# Altium schematic sheet DDS.SchDoc
size 594 x 420 mm; Address1: Address1; Address2: Address2; Address3: Address3; Address4: Address4; SheetNumber: 1; Scale: 1:1; Разраб.: Иванов; Обозначение документа: АБВГ.123456.001 Э3; Пров.: Петров; Утв.: Сидоров; Наименование организации: ОАО "Концерн "МПО-Гидроприбор"; Перв. применение: АБВГ.123456.000; Наименование изделия 1: Плата; Наименование изделия 2: Схема электрическая; Наименование изделия 3: принципиальная; Нач. отд.: Нач. отд.; Фамилия нач. отд.: Сидоров
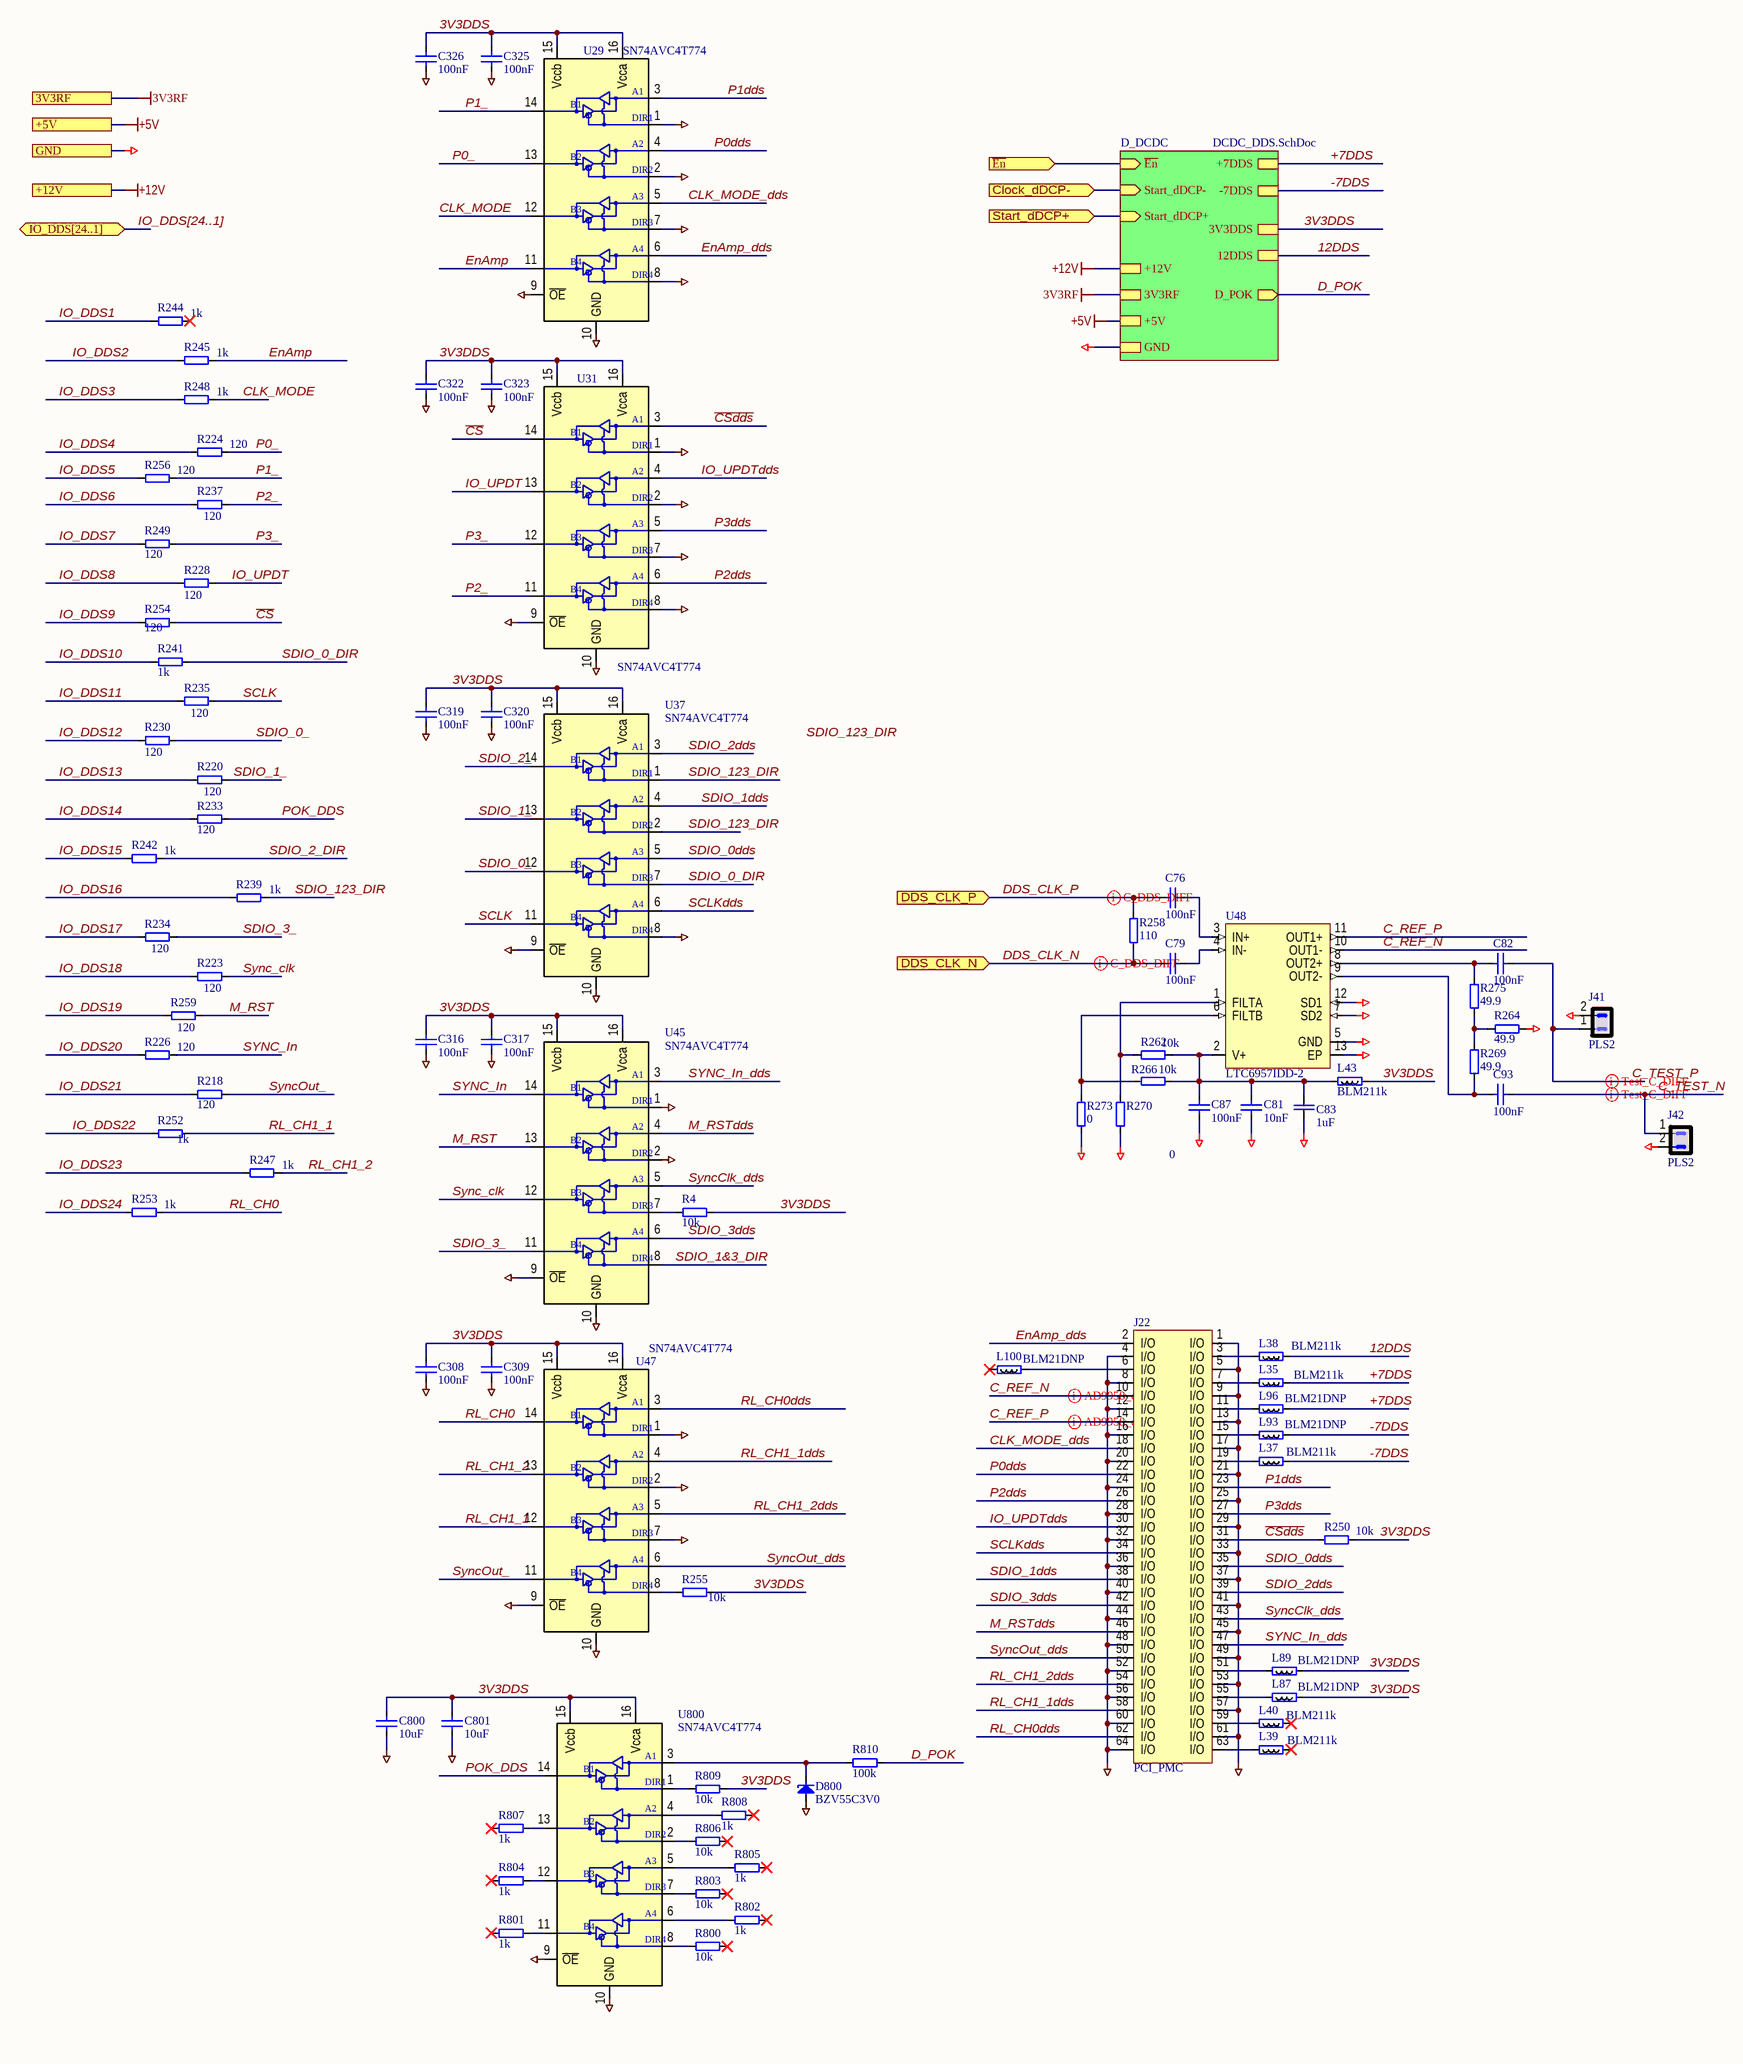
[diagram p0: DDS.SchDoc]

## Parts
C76  100nF  [CAPC1608X87N]
C79  100nF  [CAPC1608X87N]
C81  10nF  [CAPC1608X87N]
C82  100nF  [CAPC1608X87N]
C83  1uF  [0508]
C87  100nF  [CAPC1608X87N]
C93  100nF  [CAPC1608X87N]
C308  100nF  [SMD0805CAP]
C309  100nF  [SMD0805CAP]
C316  100nF  [SMD0805CAP]
C317  100nF  [SMD0805CAP]
C319  100nF  [SMD0805CAP]
C320  100nF  [SMD0805CAP]
C322  100nF  [SMD0805CAP]
C323  100nF  [SMD0805CAP]
C325  100nF  [SMD0805CAP]
C326  100nF  [SMD0805CAP]
C800  10uF  [SMD0805CAP]
C801  10uF  [SMD0805CAP]
D800  BZV55C3V0  [DIOMELF3516N]
J22  PCI_PMC  [TYCO_120521-1]
J41  PLS2  [PLS2]
J42  PLS2  [PLS2]
L35  BLM211k  [RESC2012X50N]
L37  BLM211k  [RESC2012X50N]
L38  BLM211k  [RESC2012X50N]
L39  BLM211k  [RESC2012X50N]
L40  BLM211k  [RESC2012X50N]
L43  BLM211k  [RESC2012X50N]
L87  BLM21DNP  [RESC2012X50N]
L89  BLM21DNP  [RESC2012X50N]
L93  BLM21DNP  [RESC2012X50N]
L96  BLM21DNP  [RESC2012X50N]
L100  BLM21DNP  [RESC2012X50N]
R4  10k  [SMD0805RES]
R218  120  [SMD0805RES]
R220  120  [SMD0805RES]
R223  120  [SMD0805RES]
R224  120  [SMD0805RES]
R226  120  [SMD0805RES]
R228  120  [SMD0805RES]
R230  120  [SMD0805RES]
R233  120  [SMD0805RES]
R234  120  [SMD0805RES]
R235  120  [SMD0805RES]
R237  120  [SMD0805RES]
R239  1k  [SMD0805RES]
R241  1k  [SMD0805RES]
R242  1k  [SMD0805RES]
R244  1k  [SMD0805RES]
R245  1k  [SMD0805RES]
R247  1k  [SMD0805RES]
R248  1k  [SMD0805RES]
R249  120  [SMD0805RES]
R250  10k  [SMD0805RES]
R252  1k  [SMD0805RES]
R253  1k  [SMD0805RES]
R254  120  [SMD0805RES]
R255  10k  [SMD0805RES]
R256  120  [SMD0805RES]
R258  110  [RESC1608X64N]
R259  120  [SMD0805RES]
R262  10k  [RESC1608X64N]
R264  49.9  [SMD0805RES]
R266  10k  [RESC1608X64N]
R269  49.9  [RESC1608X64N]
R270  0  [RESC1608X64N]
R273  0  [RESC1608X64N]
R275  49.9  [RESC1608X64N]
R800  10k  [SMD0805RES]
R801  1k  [SMD0805RES]
R802  1k  [SMD0805RES]
R803  10k  [SMD0805RES]
R804  1k  [SMD0805RES]
R805  1k  [SMD0805RES]
R806  10k  [SMD0805RES]
R807  1k  [SMD0805RES]
R808  1k  [SMD0805RES]
R809  10k  [SMD0805RES]
R810  100k  [SMD0805RES]
U29  SN74AVC4T774  [TSSOP-16]
U31  SN74AVC4T774  [TSSOP-16]
U37  SN74AVC4T774  [TSSOP-16]
U45  SN74AVC4T774  [TSSOP-16]
U47  SN74AVC4T774  [TSSOP-16]
U48  LTC6957IDD-2  [DFN13-045]
U800  SN74AVC4T774  [TSSOP-16]

## Sub-sheets
D_DCDC = DCDC_DDS.SchDoc: +7DDS, -7DDS, 3V3DDS, ~{En} (in), Start_dDCP- (in), Start_dDCP+ (in), +5V, GND, 3V3RF, +12V, 12DDS, D_POK (out)

## Ports
3V3RF, +5V, +12V, Clock_dDCP- (in), DDS_CLK_N (in), DDS_CLK_P (in), GND, IO_DDS[24..1] (bidir), Start_dDCP+ (in), ~{En} (in)

## Nets
3V3RF: port 3V3RF, sheet D_DCDC/3V3RF
+5V: port +5V, sheet D_DCDC/+5V
+12V: port +12V, sheet D_DCDC/+12V
GND: C81.1 C83.2 C87.1 C308.1 C309.1 C316.1 C317.1 C319.1 C320.1 C322.1 C323.1 C325.1 C326.1 C800.1 C801.1 D800.2(A) J22.1(I/O) J22.4(I/O) J22.5(I/O) J22.8(I/O) J22.9(I/O) J22.12(I/O) J22.13(I/O) J22.16(I/O) J22.17(I/O) J22.20(I/O) J22.21(I/O) J22.24(I/O) J22.25(I/O) J22.28(I/O) J22.29(I/O) J22.32(I/O) J22.33(I/O) J22.36(I/O) J22.37(I/O) J22.40(I/O) J22.41(I/O) J22.44(I/O) J22.45(I/O) J22.48(I/O) J22.49(I/O) J22.52(I/O) J22.53(I/O) J22.56(I/O) J22.57(I/O) J22.60(I/O) J22.61(I/O) J22.64(I/O) J41.2 J42.2 R264.1 R270.1 R273.1 U29.1(DIR1) U29.2(DIR2) U29.7(DIR3) U29.8(DIR4) U29.9(~{OE}) U29.10(GND) U31.1(DIR1) U31.2(DIR2) U31.7(DIR3) U31.8(DIR4) U31.9(~{OE}) U31.10(GND) U37.8(DIR4) U37.9(~{OE}) U37.10(GND) U45.1(DIR1) U45.2(DIR2) U45.9(~{OE}) U45.10(GND) U47.1(DIR1) U47.2(DIR2) U47.7(DIR3) U47.9(~{OE}) U47.10(GND) U48.5(GND) U48.7(SD2) U48.12(SD1) U48.13(EP) U800.9(~{OE}) U800.10(GND) ; port GND, sheet D_DCDC/GND
3V3DDS: C308.2 C309.2 C316.2 C317.2 C319.2 C320.2 C322.2 C323.2 C325.2 C326.2 C800.2 C801.2 L43.2 L87.2 L89.2 R4.2 R250.2 R255.1 R809.2 U29.15(Vccb) U29.16(Vcca) U31.15(Vccb) U31.16(Vcca) U37.15(Vccb) U37.16(Vcca) U45.15(Vccb) U45.16(Vcca) U47.15(Vccb) U47.16(Vcca) U800.15(Vccb) U800.16(Vcca) ; sheet D_DCDC/3V3DDS
12DDS: L38.2 ; sheet D_DCDC/12DDS
+7DDS: L35.2 L96.2 ; sheet D_DCDC/+7DDS
-7DDS: L37.2 L93.2 ; sheet D_DCDC/-7DDS
~{CS}: R254.1 U31.14(B1)
~{CSdds}: J22.31(I/O) R250.1 U31.3(A1)
~{En}: port ~{En}, sheet D_DCDC/~{En}
C_REF_N: J22.10(I/O) U48.10(OUT1-)
C_REF_P: J22.14(I/O) U48.11(OUT1+)
C_TEST_N: C93.2 J42.1
C_TEST_P: C82.2 J41.1
CLK_MODE: R248.1 U29.12(B3)
CLK_MODE_dds: J22.18(I/O) U29.5(A3)
Clock_dDCP-: port Clock_dDCP-, sheet D_DCDC/Start_dDCP-
D_POK: R810.2 ; sheet D_DCDC/D_POK
DDS_CLK_N: C79.1 R258.1 ; port DDS_CLK_N
DDS_CLK_P: C76.1 R258.2 ; port DDS_CLK_P
EnAmp: R245.1 U29.11(B4)
EnAmp_dds: J22.2(I/O) U29.6(A4)
IO_DDS1: R244.2
IO_DDS2: R245.2
IO_DDS3: R248.2
IO_DDS4: R224.2
IO_DDS5: R256.2
IO_DDS6: R237.2
IO_DDS7: R249.2
IO_DDS8: R228.2
IO_DDS9: R254.2
IO_DDS10: R241.1
IO_DDS11: R235.2
IO_DDS12: R230.2
IO_DDS13: R220.2
IO_DDS14: R233.2
IO_DDS15: R242.2
IO_DDS16: R239.2
IO_DDS17: R234.2
IO_DDS18: R223.2
IO_DDS19: R259.2
IO_DDS20: R226.2
IO_DDS21: R218.2
IO_DDS22: R252.2
IO_DDS23: R247.2
IO_DDS24: R253.2
IO_UPDT: R228.1 U31.13(B2)
IO_UPDTdds: J22.30(I/O) U31.4(A2)
M_RST: R259.1 U45.13(B2)
M_RSTdds: J22.46(I/O) U45.4(A2)
P0_: R224.1 U29.13(B2)
P0dds: J22.22(I/O) U29.4(A2)
P1_: R256.1 U29.14(B1)
P1dds: J22.23(I/O) U29.3(A1)
P2_: R237.1 U31.11(B4)
P2dds: J22.26(I/O) U31.6(A4)
P3_: R249.1 U31.12(B3)
P3dds: J22.27(I/O) U31.5(A3)
POK_DDS: R233.1 U800.14(B1)
RL_CH0: R253.1 U47.14(B1)
RL_CH0dds: J22.62(I/O) U47.3(A1)
RL_CH1_1: R252.1 U47.12(B3)
RL_CH1_1dds: J22.58(I/O) U47.4(A2)
RL_CH1_2: R247.1 U47.13(B2)
RL_CH1_2dds: J22.54(I/O) U47.5(A3)
SCLK: R235.1 U37.11(B4)
SCLKdds: J22.34(I/O) U37.6(A4)
SDIO_0_: R230.1 U37.12(B3)
SDIO_0_DIR: R241.2 U37.7(DIR3)
SDIO_0dds: J22.35(I/O) U37.5(A3)
SDIO_1&3_DIR: U45.8(DIR4)
SDIO_1_: R220.1 U37.13(B2)
SDIO_1dds: J22.38(I/O) U37.4(A2)
SDIO_2_: U37.14(B1)
SDIO_2_DIR: R242.1
SDIO_2dds: J22.39(I/O) U37.3(A1)
SDIO_3_: R234.1 U45.11(B4)
SDIO_3dds: J22.42(I/O) U45.6(A4)
SDIO_123_DIR: R239.1 U37.1(DIR1) U37.2(DIR2)
Start_dDCP+: port Start_dDCP+, sheet D_DCDC/Start_dDCP+
Sync_clk: R223.1 U45.12(B3)
SYNC_In: R226.1 U45.14(B1)
SYNC_In_dds: J22.47(I/O) U45.3(A1)
SyncClk_dds: J22.43(I/O) U45.5(A3)
SyncOut_: R218.1 U47.11(B4)
SyncOut_dds: J22.50(I/O) U47.6(A4)
NetC76_2: C76.2 U48.3(IN+)
NetC79_2: C79.2 U48.4(IN-)
NetC81_2: C81.2 C83.1 C87.2 L43.1 R262.2 R266.2 U48.2(V+)
NetC82_1: C82.1 R275.2 U48.8(OUT2+)
NetC93_1: C93.1 R269.1 U48.9(OUT2-)
NetD800_1: D800.1(C) R810.1 U800.3(A1)
NetJ22_3: J22.3(I/O) L38.1
NetJ22_6: J22.6(I/O) L100.2
NetJ22_7: J22.7(I/O) L35.1
NetJ22_11: J22.11(I/O) L96.1
NetJ22_15: J22.15(I/O) L93.1
NetJ22_19: J22.19(I/O) L37.1
NetJ22_51: J22.51(I/O) L89.1
NetJ22_55: J22.55(I/O) L87.1
NetJ22_59: J22.59(I/O) L40.1
NetJ22_63: J22.63(I/O) L39.1
NetR4_1: R4.1 U45.7(DIR3)
NetR255_2: R255.2 U47.8(DIR4)
NetR262_1: R262.1 R270.2 U48.1(FILTA)
NetR264_2: R264.2 R269.2 R275.1
NetR266_1: R266.1 R273.2 U48.6(FILTB)
NetR800_1: R800.1 U800.8(DIR4)
NetR801_2: R801.2 U800.11(B4)
NetR802_1: R802.1 U800.6(A4)
NetR803_1: R803.1 U800.7(DIR3)
NetR804_2: R804.2 U800.12(B3)
NetR805_1: R805.1 U800.5(A3)
NetR806_1: R806.1 U800.2(DIR2)
NetR807_2: R807.2 U800.13(B2)
NetR808_1: R808.1 U800.4(A2)
NetR809_1: R809.1 U800.1(DIR1)

Not connected (* = marked no-connect by the designer): L39 2*; L40 2*; L100 1*; R244 1*; R800 2*; R801 1*; R802 2*; R803 2*; R804 1*; R805 2*; R806 2*; R807 1*; R808 2*

## Buses and harness runs
bus IO_DDS[24..1] = port IO_DDS[24..1]

## Layout directives
differential pair: C_REF_N, C_REF_P, C_TEST_N, C_TEST_P
differential pair; rule Differential Pairs Routing [Pref Gap = 0.175mm    Min Gap  = 0.075mm    Max Gap  = 0.5mmPref Width = 0.25mm    Min Width  = 0.075mm    Max Width  = 0.5mm]: DDS_CLK_N, DDS_CLK_P

## Notes on the sheet
- Labels drawn without touching a wire or pin: SDIO_123_DIR
- Подп. и дата
- Инв. № дубл.
- Взам. инв. №
- Инв. № подл.
- Изм.
- Лист
- № докум.
- Подп.
- Дата
- Копировал
- Формат А2

## Library data of the parts
C76 C79 C81 C82 C87 C93 = C0603: Чип конденсатор 0603; Voltage: 50V; Vendor: Vishay; DielectricType: X5R; SMD Solders: 2; Solder Option: RM; Tolerance: 20%; Pkg: SMD0603; Device: Cap603; Price: 2
  C76 C79 C82 C87 C93: Value: 100nF
  C81: Value: 10nF
C83 = CAP_LLL219R71A105: 1uF; 10V; 0805R; X7R; Low ESL; Reverse geometry; Vendor: muRata; SolderOption: 2; THD Solders: 0; PartField: LLL219R71A105; Pkg: 0508; Value: 1uF; SMD Solders: 2; ClassName: Soldered_BINP
C308 C309 C316 C317 C319 C320 C322 C323 C325 C326 C800 C801 = C0805: Чип конденсатор 0805; Voltage: 25V; Vendor: Vishay; DielectricType: X5R; SMD Solders: 2; Solder Option: RM; Tolerance: 20%; Pkg: SMD0805; Device: Cap0805; Price: 2
  C308 C309 C316 C317 C319 C320 C322 C323 C325 C326: Value: 100nF
  C800 C801: Value: 10uF
D800 = BZV55C: Чип cтабилитрон; Vendor: LGE; Value: 3V0; Voltage: 3V; SMD Solders: 2; Solder Option: RM; Pkg: SOD80; Current: 5; Price: 5; Device: BZV55C; Name to order: BZV55C3V0
J22 = PCI_PMC_M: PCI Mezzanine Connector; IEEE 1386 MainBoard; Manufactuer: TE Connectivity; PartField: 120527-1; SolderOption: 2; Pkg: PMC Male (IEEE 1386); Value: PCI_PMC; Vendor: TE Connectivity
J41 J42 = PLS2: Vendor: Confly; SMD Solders: 0; Solder Option: RM; THD Solders: 2; Price: 1; Device: PLS2
L35 L37-L40 L43 = BLM21: SMD Ferrite bead 0805; Vendor: Vishay; Value: 1k; Pkg: SMD0805; SMD Solders: 2; Solder Option: RM; Price: 10; Device: BLM21
L87 L89 L93 L96 L100 = BLM21: SMD Ferrite bead 0805; Vendor: Vishay; Value: DNP; Pkg: SMD0805; SMD Solders: 2; Solder Option: RM; Price: 10; Device: BLM21
R4 R241 R250 R264 R809 R810 = R0805: Чип резистор 0805; Vendor: Vishay; SMD Solders: 2; Solder Option: RM; TC: 100ppm/C; Tolerance: 1%; Pkg: SMD0805; Pwr: 125mW; Device: Res0805; Price: 2
  R4 R250 R809: Value: 10k
  R241: Value: 1k
  R264: Value: 49.9
  R810: Value: 100k
R218 R220 R223 R224 R226 R228 R230 R233-R235 R237 R239 R242 R244 R245 R247-R249 R252-R256 R259 = R0805: Чип резистор 0805; Vendor: Vishay; SMD Solders: 2; Solder Option: i; TC: 100ppm/C; Tolerance: 1%; Pkg: SMD0805; Pwr: 125mW; Device: Res0805; Price: 2
  R218 R220 R223 R224 R226 R228 R230 R233-R235 R237 R249 R254 R256 R259: Value: 120
  R239 R242 R244 R245 R247 R248 R252 R253: Value: 1k
  R255: Value: 10k
R258 R262 R266 R269 R270 R273 R275 = R0603: Чип резистор 0603; Vendor: Vishay; SMD Solders: 2; Solder Option: RM; TC: 100ppm/C; Tolerance: 1%; Pkg: SMD0603; Pwr: 60mW; Device: Res603; Price: 2
  R258: Value: 110
  R262 R266: Value: 10k
  R269 R275: Value: 49.9
  R270 R273: Value: 0
R800-R808 = R0805: Чип резистор 0805; Vendor: Vishay; SMD Solders: 2; Solder Option: DNP; TC: 100ppm/C; Tolerance: 1%; Pkg: SMD0805; Pwr: 125mW; Device: Res0805; Price: 2
  R800 R803 R806: Value: 10k
  R801 R802 R804 R805 R807 R808: Value: 1k
U29 U31 U37 U45 U47 U800 = SN74AVC4T774: Двунаправленный буфер; Pkg: TSSOP16; SMD Solders: 16; Solder Option: RM; THD Solders: 0; Vendor: Texas Instruments; Voltage: 1V1.. 3.6V  I/Os are 4.6-V Tolerant; Name to order: SN74AVC4T774PW; Device: SN74AVC4T774; Price: 300
U48 = LTC6957-2: Bufer CMOS in to 2xLVDS out; Vendor: Analog Devices; Pkg: DFN045-13; SMD Solders: 13; Solder Option: outSrc; THD Solders: 0; Current: 72; Voltage: 2.15.. 3.45; Price: 4200; Device: LTC6957IDD-2; Name to order: LTC6957IDD-2